# EAGLE design Driver4portas (EAGLE 7.2.0)
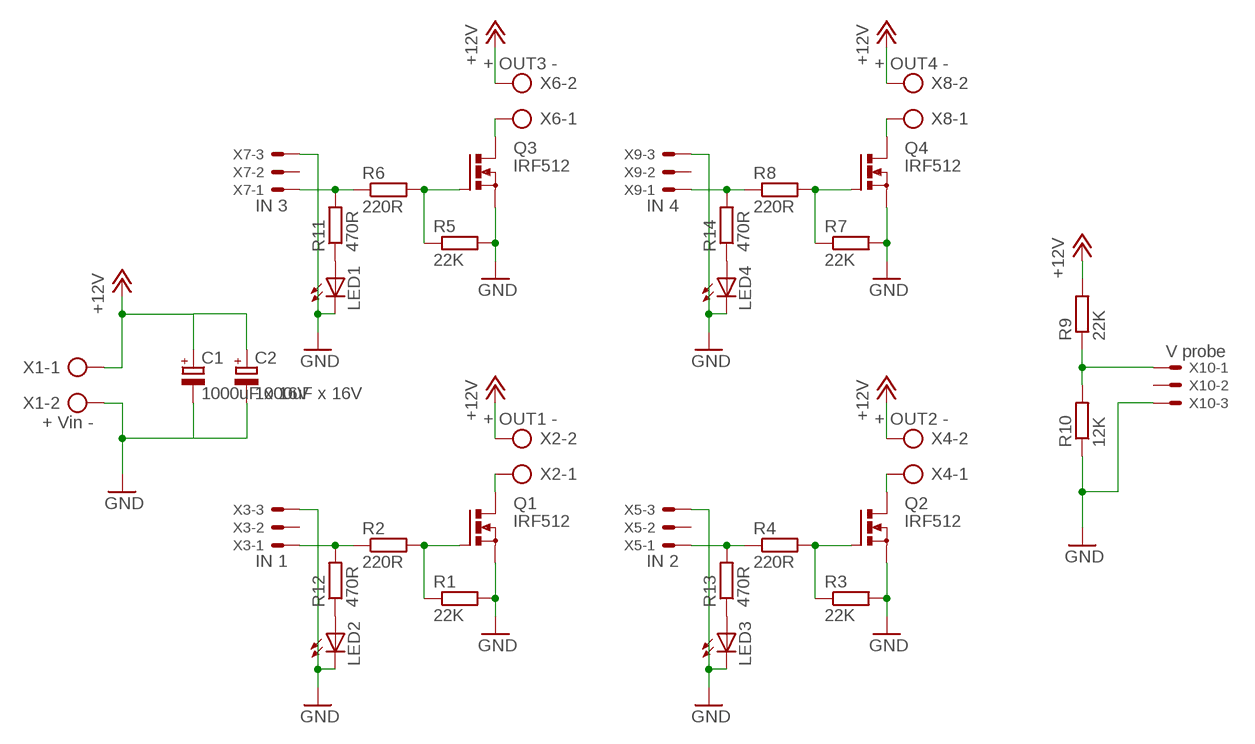
[diagram p0: schematic, sheet 1]

## Parts
C1  1000uF x 16V  CPOL-EUE2.5-7  [E2,5-7]
C2  1000uF x 16V  CPOL-EUE2.5-7  [E2,5-7]
LED1  LED3MM  [LED3MM]
LED2  LED3MM  [LED3MM]
LED3  LED3MM  [LED3MM]
LED4  LED3MM  [LED3MM]
Q1  IRF512  [TO220BV]
Q2  IRF512  [TO220BV]
Q3  IRF512  [TO220BV]
Q4  IRF512  [TO220BV]
R1  22K  R-EU_0204/7  [0204/7]
R2  220R  R-EU_0204/7  [0204/7]
R3  22K  R-EU_0204/7  [0204/7]
R4  220R  R-EU_0204/7  [0204/7]
R5  22K  R-EU_0204/7  [0204/7]
R6  220R  R-EU_0204/7  [0204/7]
R7  22K  R-EU_0204/7  [0204/7]
R8  220R  R-EU_0204/7  [0204/7]
R9  22K  R-EU_0204/7  [0204/7]
R10  12K  R-EU_0204/7  [0204/7]
R11  470R  R-EU_0204/2V  [0204V]
R12  470R  R-EU_0204/2V  [0204V]
R13  470R  R-EU_0204/2V  [0204V]
R14  470R  R-EU_0204/2V  [0204V]
X1  + Vin -  AK500/2  [AK500/2]
X2  + OUT1 -  AK500/2  [AK500/2]
X3  IN 1  22-23-2031  [22-23-2031]
X4  + OUT2 -  AK500/2  [AK500/2]
X5  IN 2  22-23-2031  [22-23-2031]
X6  + OUT3 -  AK500/2  [AK500/2]
X7  IN 3  22-23-2031  [22-23-2031]
X8  + OUT4 -  AK500/2  [AK500/2]
X9  IN 4  22-23-2031  [22-23-2031]
X10  V probe  22-23-2031  [22-23-2031]

## Nets
+12V: C1.+ C2.+ R9.2 X1.1 X2.2 X4.2 X6.2 X8.2
GND: C1.- C2.- LED1.K(C) LED2.K(C) LED3.K(C) LED4.K(C) Q1.S Q2.S Q3.S Q4.S R1.2 R3.2 R5.2 R7.2 R10.1 X1.2 X3.3 X5.3 X7.3 X9.3 X10.3
N$1: R2.1 R12.2 X3.1
N$2: Q1.G R1.1 R2.2
N$3: Q1.D X2.1
N$4: Q2.G R3.1 R4.2
N$5: Q2.D X4.1
N$6: R4.1 R13.2 X5.1
N$7: Q3.G R5.1 R6.2
N$8: Q3.D X6.1
N$9: R6.1 R11.2 X7.1
N$10: Q4.G R7.1 R8.2
N$11: Q4.D X8.1
N$12: R8.1 R14.2 X9.1
N$13: R9.1 R10.2 X10.1
N$14: LED1.A R11.1
N$15: LED2.A R12.1
N$16: LED3.A R13.1
N$17: LED4.A R14.1
Unconnected: X3.2 X5.2 X7.2 X9.2 X10.2

## Library data of the parts
C1 C2 = rcl:CPOL-EU: POLARIZED CAPACITOR, European symbol
LED1-LED4 = led:LED: LED OSRAM: - CHIPLED LG R971, LG N971, LY N971, LG Q971, LY Q971, LO R971, LY R971 LH N974, LH R974 LS Q976, LO Q976, LY Q976 LO Q996 - Hyper CHIPLED LW Q18S LB Q993, LB Q99A, LB R99A - SideLED LS A670, LO A670, LY A670, LG A670, LP A670 LB A673, LV A673, LT A673, LW A673 LH A674 LY A675 LS A676, LA A676, LO A676, LY A676, LW A676 LS A679, LY A679, LG A679 - Hyper Micro SIDELED® LS Y876, LA Y876, LO Y876, LY Y876 LT Y87S - SmartLED LW L88C, LW L88S LB L89C, LB L89S, LG L890 LS L89K, LO L89K, LY L89K LS L896, LA L896, LO L896, LY L896 - TOPLED LS T670, LO T670, LY T670, LG T670, LP T670 LSG T670, LSP T670, LSY T670, LOP T670, LYG T670 LG T671, LOG T671, LSG T671 LB T673, LV T673, LT T673, LW T673 LH T674 LS T676, LA T676, LO T676, LY T676, LB T676, LH T676, LSB T676, LW T676 LB T67C, LV T67C, LT T67C, LS T67K, LO T67K, LY T67K, LW E67C LS E67B, LA E67B, LO E67B, LY E67B, LB E67C, LV E67C, LT E67C LW T67C LS T679, LY T679, LG T679 LS T770, LO T770, LY T770, LG T770, LP T770 LB T773, LV T773, LT T773, LW T773 LH T774 LS E675, LA E675, LY E675, LS T675 LS T776, LA T776, LO T776, LY T776, LB T776 LHGB T686 LT T68C, LB T68C - Hyper Mini TOPLED® LB M676 - Mini TOPLED Santana® LG M470 LS M47K, LO M47K, LY M47K Source: http://www.osram.convergy.de LUXEON: - LUMILED® LXK2-PW12-R00, LXK2-PW12-S00, LXK2-PW14-U00, LXK2-PW14-V00 LXK2-PM12-R00, LXK2-PM12-S00, LXK2-PM14-U00 LXK2-PE12-Q00, LXK2-PE12-R00, LXK2-PE12-S00, LXK2-PE14-T00, LXK2-PE14-U00 LXK2-PB12-K00, LXK2-PB12-L00, LXK2-PB12-M00, LXK2-PB14-N00, LXK2-PB14-P00, LXK2-PB14-Q00 LXK2-PR12-L00, LXK2-PR12-M00, LXK2-PR14-Q00, LXK2-PR14-R00 LXK2-PD12-Q00, LXK2-PD12-R00, LXK2-PD12-S00 LXK2-PH12-R00, LXK2-PH12-S00 LXK2-PL12-P00, LXK2-PL12-Q00, LXK2-PL12-R00 Source: www.luxeon.com KINGBRIGHT: KA-3528ASYC Source: www.kingbright.com
Q1-Q4 = transistor-power:IRF512: N-CHANNEL MOS FET
R1-R14 = rcl:R-EU_: RESISTOR, European symbol
X1 X2 X4 X6 X8 = con-ptr500:AK500/2: CONNECTOR; OC_FARNELL: unknown; OC_NEWARK: unknown
X3 X5 X7 X9 X10 = con-molex:22-23-2031: .100" (2.54mm) Center Header - 3 Pin; MF: MOLEX; MPN: 22-23-2031; OC_FARNELL: 1462950; OC_NEWARK: 30C0862

## Board
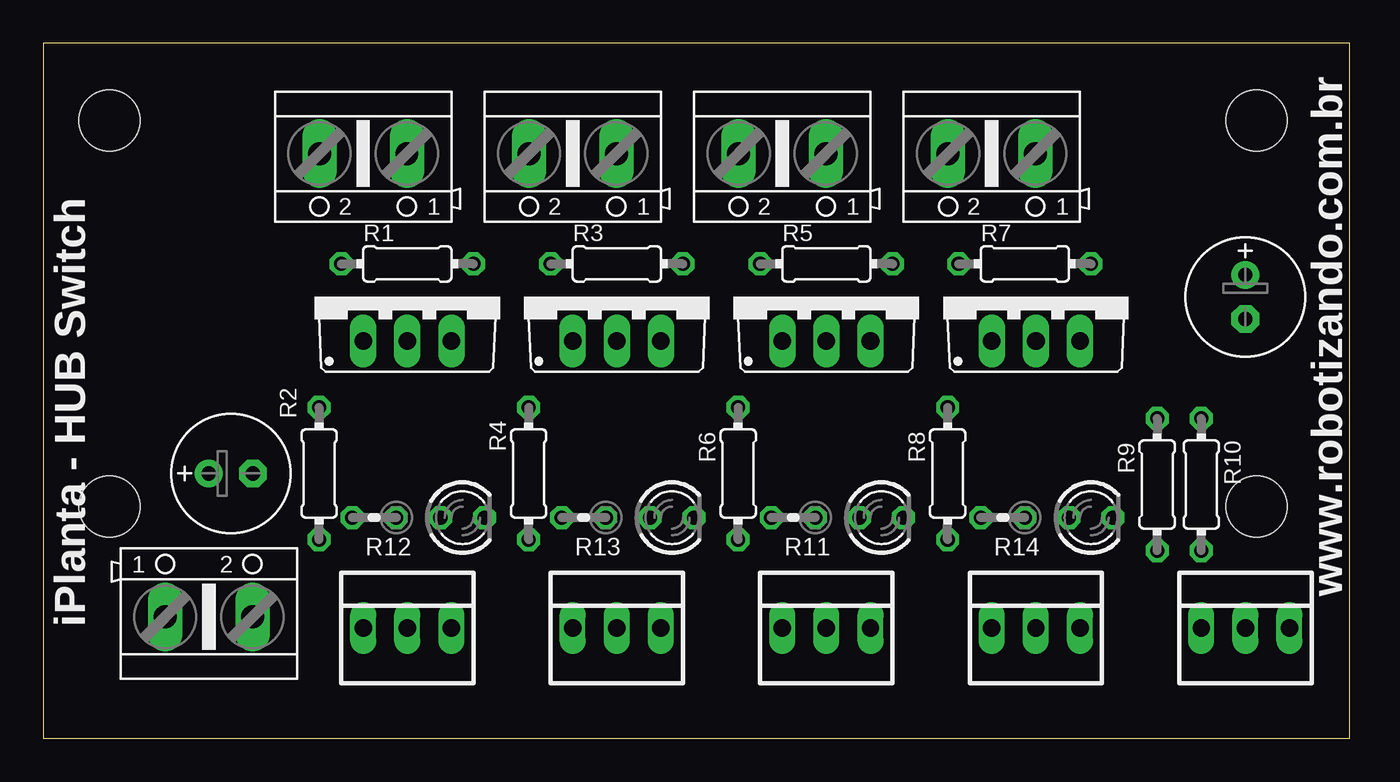
[diagram p1: board, top side]
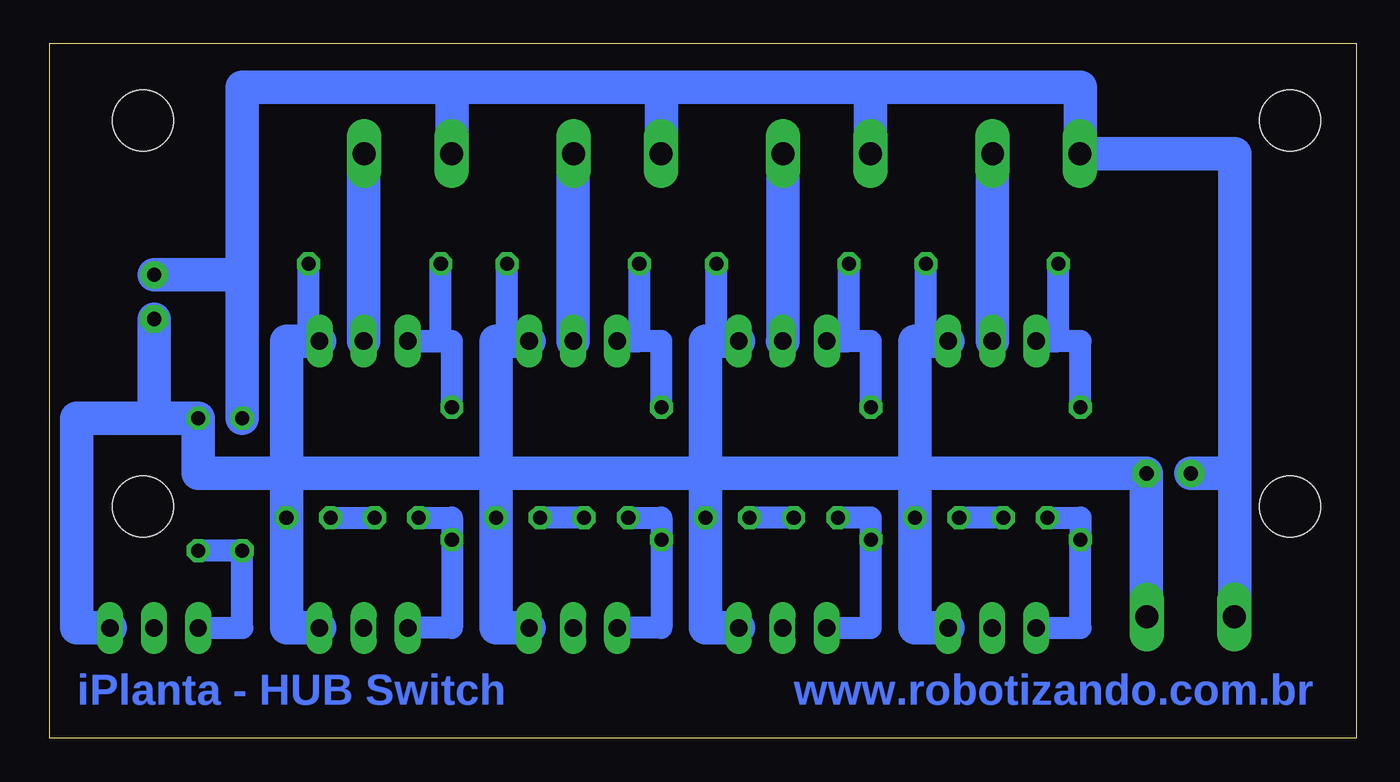
[diagram p2: board, bottom side, seen from below]

Size 75.24 x 39.99 mm. Coordinates in mm from the lower left corner, seen from the top.
Outline: 0,0 75.24,0 75.24,39.99 0,39.99 0,0
Copper layers (1*16): Top 0.035mm / dielectric 1.5mm / Bottom 0.035mm
Design rules "default": minimum track width 10mil, minimum drill 24mil, track to track 8mil, track to pad 8mil, pad to pad 8mil, via to via 8mil, smd to smd 8mil, copper to edge 40mil, drill to drill 8mil, minimum pad ring 10mil, minimum via ring 8mil, stop-mask expansion 4mil, vias tented up to drill 0mil, thermal gap 10mil
Holes 3.5 mm at 3.81,13.34 3.81,35.56 69.85,35.56 69.85,13.34

### Footprints (pad centres in the part's own frame; a part is rotated, then mirrored left to right if it is on the bottom)
E2,5-7 = drill 0.813 pad 1.6: + -1.27,0 | drill 0.813 pad 1.6 octagon: - 1.27,0
LED3MM = drill 0.813 octagon: A -1.27,0; K 1.27,0
TO220BV = drill 1.016 long: D 0,-2.54; G -2.54,-2.54; S 2.54,-2.54
0204/7 = drill 0.813 octagon: 1 -3.81,0; 2 3.81,0
0204V = drill 0.813 octagon: 1 -1.27,0; 2 1.27,0
AK500/2 = drill 1.321 long: 1 -2.515,0; 2 2.515,0
22-23-2031 = drill 1 long: 1 -2.54,0; 2 0,0; 3 2.54,0

### Placement (x,y rotation side)
C1  10.79,15.24 0 top
C2  69.22,25.4 270 top
LED1  48.26,12.7 0 top
LED2  24.13,12.7 0 top
LED3  36.2,12.7 0 top
LED4  60.33,12.7 0 top
Q1  20.96,25.4 0 top
Q2  33.02,25.4 0 top
Q3  45.09,25.4 0 top
Q4  57.15,25.4 0 top
R1  20.96,27.3 0 top
R2  15.88,15.24 90 top
R3  33.02,27.3 0 top
R4  27.94,15.24 90 top
R5  45.09,27.3 0 top
R6  40.01,15.24 90 top
R7  56.52,27.3 0 top
R8  52.07,15.24 90 top
R9  64.13,14.61 90 top
R10  66.67,14.61 270 top
R11  43.18,12.7 180 top
R12  19.05,12.7 180 top
R13  31.12,12.7 180 top
R14  55.24,12.7 180 top
X1  9.53,6.99 0 top
X2  18.41,33.66 180 top
X3  20.96,6.35 0 top
X4  30.48,33.66 180 top
X5  33.02,6.35 0 top
X6  42.55,33.66 180 top
X7  45.09,6.35 0 top
X8  54.61,33.66 180 top
X9  57.15,6.35 0 top
X10  69.22,6.35 0 top

### Tracks (layer width: path | path; a pad name or v marks a point on that pad's centre or on a via)
+12V
  Bottom 1.93: X1.1 6.99,6.99 6.99,15.24 | 6.99,15.24 C1.+ | 6.99,15.24 6.99,33.66 X2.2 15.88,33.66 15.88,37.47 27.96,37.47 | 27.96,37.47 X4.2 | X6.2 40.01,33.66 40.01,37.47 | 40.01,37.47 27.96,37.47 | X8.2 52.07,33.66 52.07,37.47 | 52.07,37.47 40.01,37.47 | R9.2 64.13,26.67 | 64.13,26.67 64.13,37.47 52.07,37.47 | C2.+ 64.13,26.67
GND
  Bottom 1.27: Q1.S 24.77,22.86 R1.2 | Q2.S 36.83,22.86 R3.2 | Q3.S 48.9,22.86 R5.2 | Q4.S 60.33,22.86 R7.2
  Bottom 1.93: X1.2 12.07,6.35 C1.- 25.4,15.24 | 25.4,15.24 37.47,15.24 | 37.47,15.24 49.53,15.24 | 49.53,15.24 61.59,15.24 | 61.59,15.24 61.59,22.86 Q4.S | Q3.S 49.53,22.86 49.53,15.24 | Q2.S 37.47,22.86 37.47,15.24 | Q1.S 25.4,22.86 25.4,15.24 | X3.3 25.4,6.35 LED2.K 25.4,15.24 | X5.3 37.47,6.35 LED3.K 37.47,15.24 | X7.3 49.53,6.35 LED1.K 49.53,15.24 | X9.3 61.59,6.35 LED4.K 61.59,15.24 | X10.3 73.66,6.35 73.66,18.41 69.22,18.41 | 69.22,18.41 R10.1 66.67,15.24 61.59,15.24 | C2.- 69.22,18.41
N$1
  Bottom 1.27: X3.1 15.88,6.35 R2.1 15.88,12.7 R12.2
N$2
  Bottom 1.27: R1.1 17.14,22.86 Q1.G 15.88,22.86 R2.2
N$3
  Bottom 1.93: Q1.D 20.93,22.86 X2.1
N$4
  Bottom 1.27: R3.1 29.21,22.86 Q2.G 27.94,22.86 R4.2
N$5
  Bottom 1.93: Q2.D 33,22.86 X4.1
N$6
  Bottom 1.27: X5.1 27.94,6.35 R4.1 27.94,12.7 R13.2
N$7
  Bottom 1.27: R5.1 41.27,22.86 Q3.G 40.01,22.86 R6.2
N$8
  Bottom 1.93: X6.1 45.09,33.66 Q3.D
N$9
  Bottom 1.27: X7.1 40.01,6.35 R6.1 40.01,12.7 R11.2
N$10
  Bottom 1.27: R7.1 52.7,22.86 Q4.G 52.07,22.86 R8.2
N$11
  Bottom 1.93: X8.1 57.15,33.66 Q4.D
N$12
  Bottom 1.27: X9.1 52.07,6.35 R8.1 52.07,12.7 R14.2
N$13
  Bottom 1.27: X10.1 64.13,6.35 R9.1 R10.2
N$14
  Bottom 1.27: R11.1 LED1.A
N$15
  Bottom 1.27: R12.1 LED2.A
N$16
  Bottom 1.27: R13.1 LED3.A
N$17
  Bottom 1.27: LED4.A R14.1

### Text on the board
Bottom: www.robotizando.com.br | iPlanta - HUB Switch
tPlace: www.robotizando.com.br | iPlanta - HUB Switch